# EAGLE design heatedBed (EAGLE 7.0.0)
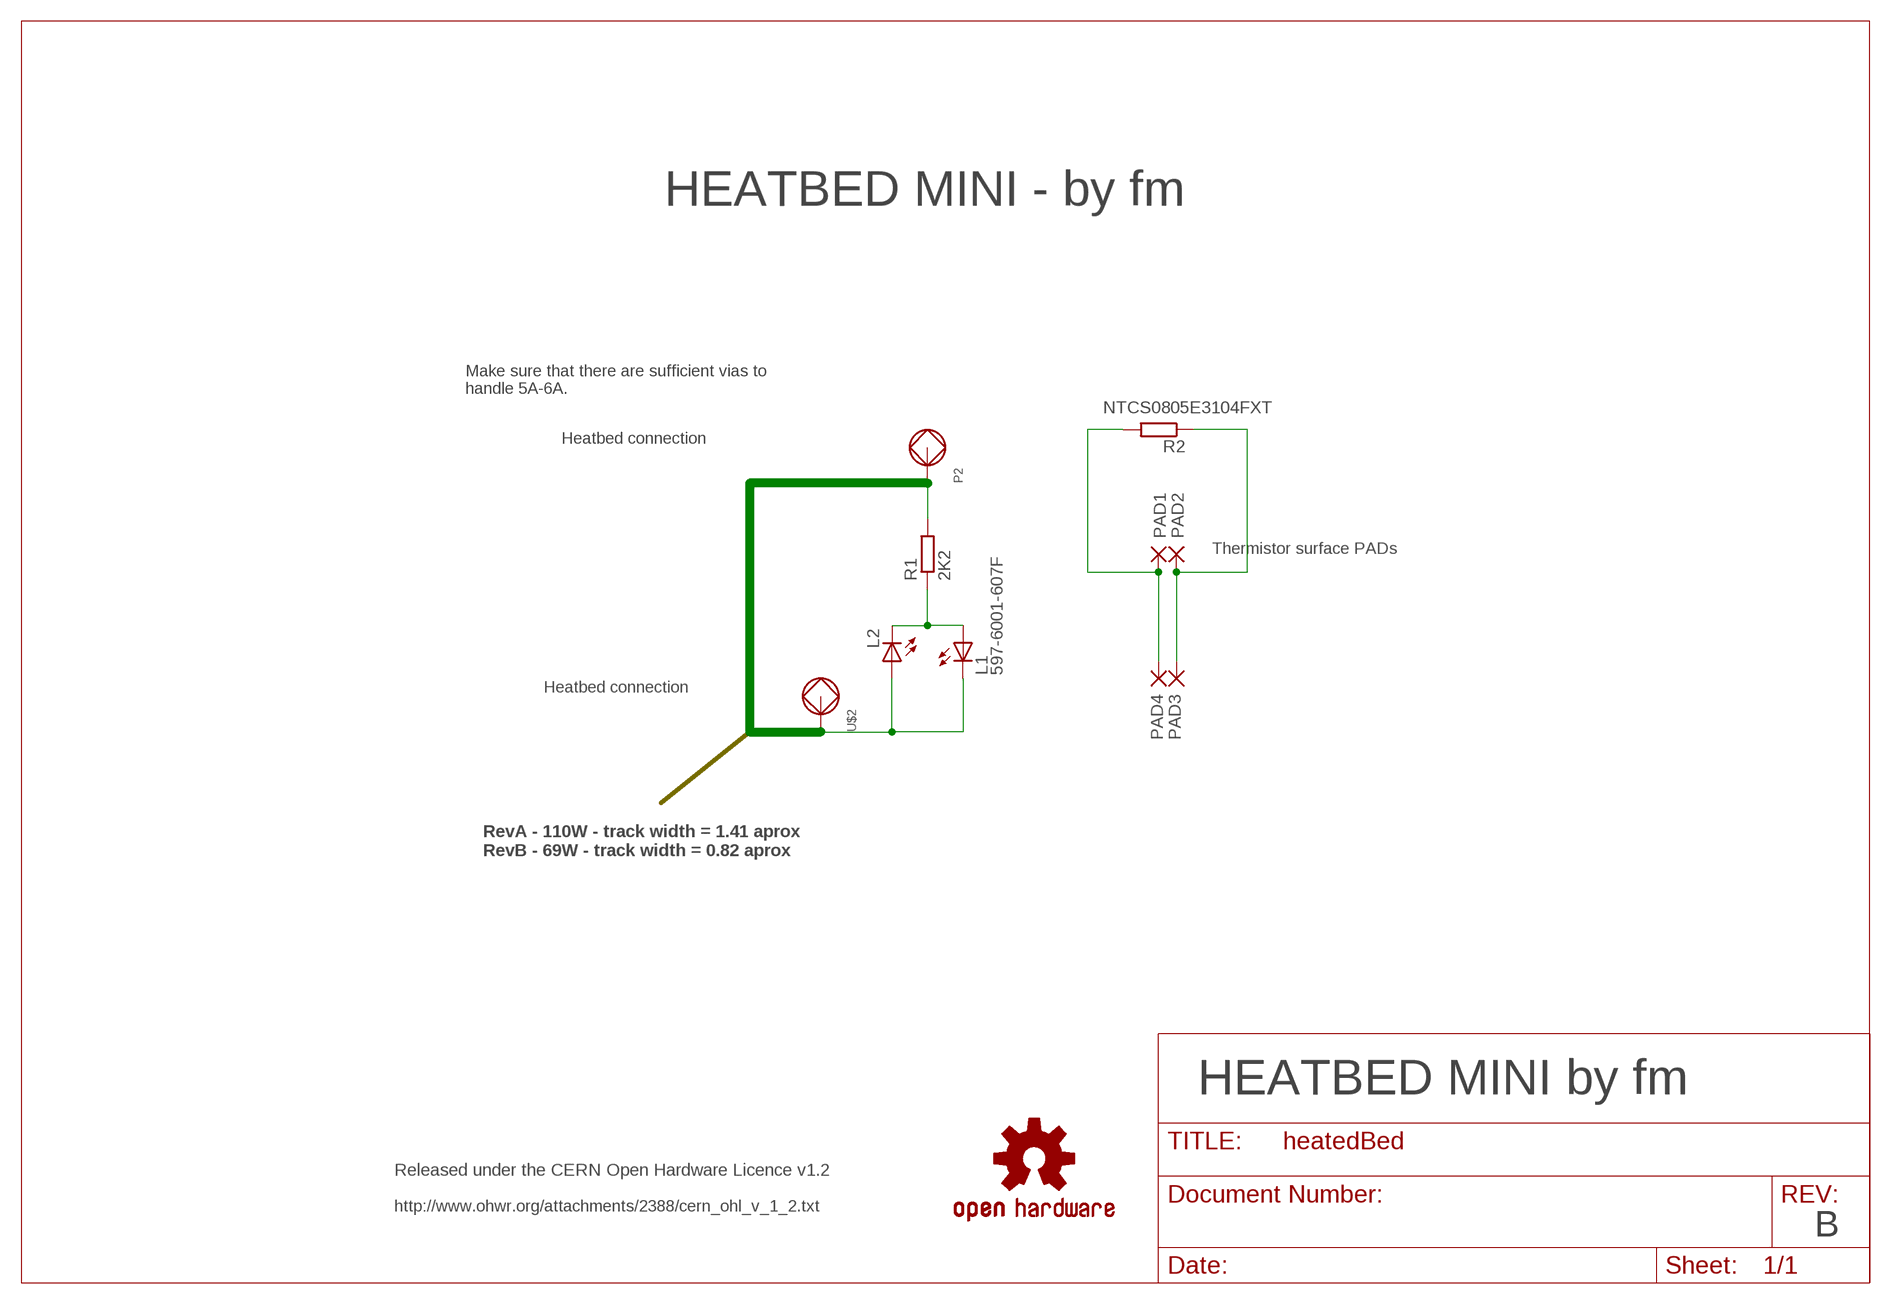
[diagram p0: schematic, sheet 1]

## Parts
L1  597-6001-607F  LEDCHIPLED_1206_REV  [CHIPLED_1206_REVERSE]
L2  LEDCHIPLED_1206_REV  [CHIPLED_1206_REVERSE]
P2  LONG_PAD  [LONG_PAD]
PAD1  SMD5  [SMD2,54-5,08]
PAD2  SMD5  [SMD2,54-5,08]
PAD3  SMD5  [SMD2,54-5,08]
PAD4  SMD5  [SMD2,54-5,08]
R1  2K2  R-EU_R0805  [R0805]
R2  NTCS0805E3104FXT  R-EU_R0805  [R0805]
U$2  LONG_PAD  [LONG_PAD]
U$5  SPARKFUN_OSHW-LOGOL  [SPARKFUN_OSHW-LOGO-L]

## Nets
N$3: PAD1.1(P) PAD4.1(P) R2.2
N$4: L1.A L2.C R1.1
N$5: PAD2.1(P) PAD3.1(P) R2.1
P1: L1.C L2.A P2.P$1 P2.P$2 P2.P$3 R1.2 U$2.P$1 U$2.P$2 U$2.P$3

## Notes on the sheet
- HEATBED MINI - by fm
- Make sure that there are sufficient vias to
  handle 5A-6A.
- Heatbed connection
- Thermistor surface PADs
- Heatbed connection
- RevA - 110W - track width = 1.41 aprox 
  RevB - 69W - track width = 0.82 aprox
- HEATBED MINI by fm
- Released under the CERN Open Hardware Licence v1.2
- http://www.ohwr.org/attachments/2388/cern_ohl_v_1_2.txt
- B

## Library data of the parts
L1 L2 = led:LED: LED OSRAM: - CHIPLED LG R971, LG N971, LY N971, LG Q971, LY Q971, LO R971, LY R971 LH N974, LH R974 LS Q976, LO Q976, LY Q976 LO Q996 - Hyper CHIPLED LW Q18S LB Q993, LB Q99A, LB R99A - SideLED LS A670, LO A670, LY A670, LG A670, LP A670 LB A673, LV A673, LT A673, LW A673 LH A674 LY A675 LS A676, LA A676, LO A676, LY A676, LW A676 LS A679, LY A679, LG A679 - Hyper Micro SIDELED® LS Y876, LA Y876, LO Y876, LY Y876 LT Y87S - SmartLED LW L88C, LW L88S LB L89C, LB L89S, LG L890 LS L89K, LO L89K, LY L89K LS L896, LA L896, LO L896, LY L896 - TOPLED LS T670, LO T670, LY T670, LG T670, LP T670 LSG T670, LSP T670, LSY T670, LOP T670, LYG T670 LG T671, LOG T671, LSG T671 LB T673, LV T673, LT T673, LW T673 LH T674 LS T676, LA T676, LO T676, LY T676, LB T676, LH T676, LSB T676, LW T676 LB T67C, LV T67C, LT T67C, LS T67K, LO T67K, LY T67K, LW E67C LS E67B, LA E67B, LO E67B, LY E67B, LB E67C, LV E67C, LT E67C LW T67C LS T679, LY T679, LG T679 LS T770, LO T770, LY T770, LG T770, LP T770 LB T773, LV T773, LT T773, LW T773 LH T774 LS E675, LA E675, LY E675, LS T675 LS T776, LA T776, LO T776, LY T776, LB T776 LHGB T686 LT T68C, LB T68C - Hyper Mini TOPLED® LB M676 - Mini TOPLED Santana® LG M470 LS M47K, LO M47K, LY M47K Source: http://www.osram.convergy.de LUXEON: - LUMILED® LXK2-PW12-R00, LXK2-PW12-S00, LXK2-PW14-U00, LXK2-PW14-V00 LXK2-PM12-R00, LXK2-PM12-S00, LXK2-PM14-U00 LXK2-PE12-Q00, LXK2-PE12-R00, LXK2-PE12-S00, LXK2-PE14-T00, LXK2-PE14-U00 LXK2-PB12-K00, LXK2-PB12-L00, LXK2-PB12-M00, LXK2-PB14-N00, LXK2-PB14-P00, LXK2-PB14-Q00 LXK2-PR12-L00, LXK2-PR12-M00, LXK2-PR14-Q00, LXK2-PR14-R00 LXK2-PD12-Q00, LXK2-PD12-R00, LXK2-PD12-S00 LXK2-PH12-R00, LXK2-PH12-S00 LXK2-PL12-P00, LXK2-PL12-Q00, LXK2-PL12-R00 Source: www.luxeon.com KINGBRIGHT: KA-3528ASYC Source: www.kingbright.com
P2 U$2 = fmc:LONG_PAD
PAD1-PAD4 = wirepad:SMD5: SMD PAD
R1 R2 = rcl:R-EU_: RESISTOR, European symbol
U$5 = SAVLibSAV MK-I:SPARKFUN_OSHW-LOGO: Open Source Hardware Logo This logo indicates the piece of hardware it is found on incorporates a OSHW license and/or adheres to the definition of open source hardware found here: http://freedomdefined.org/OSHW

## Board
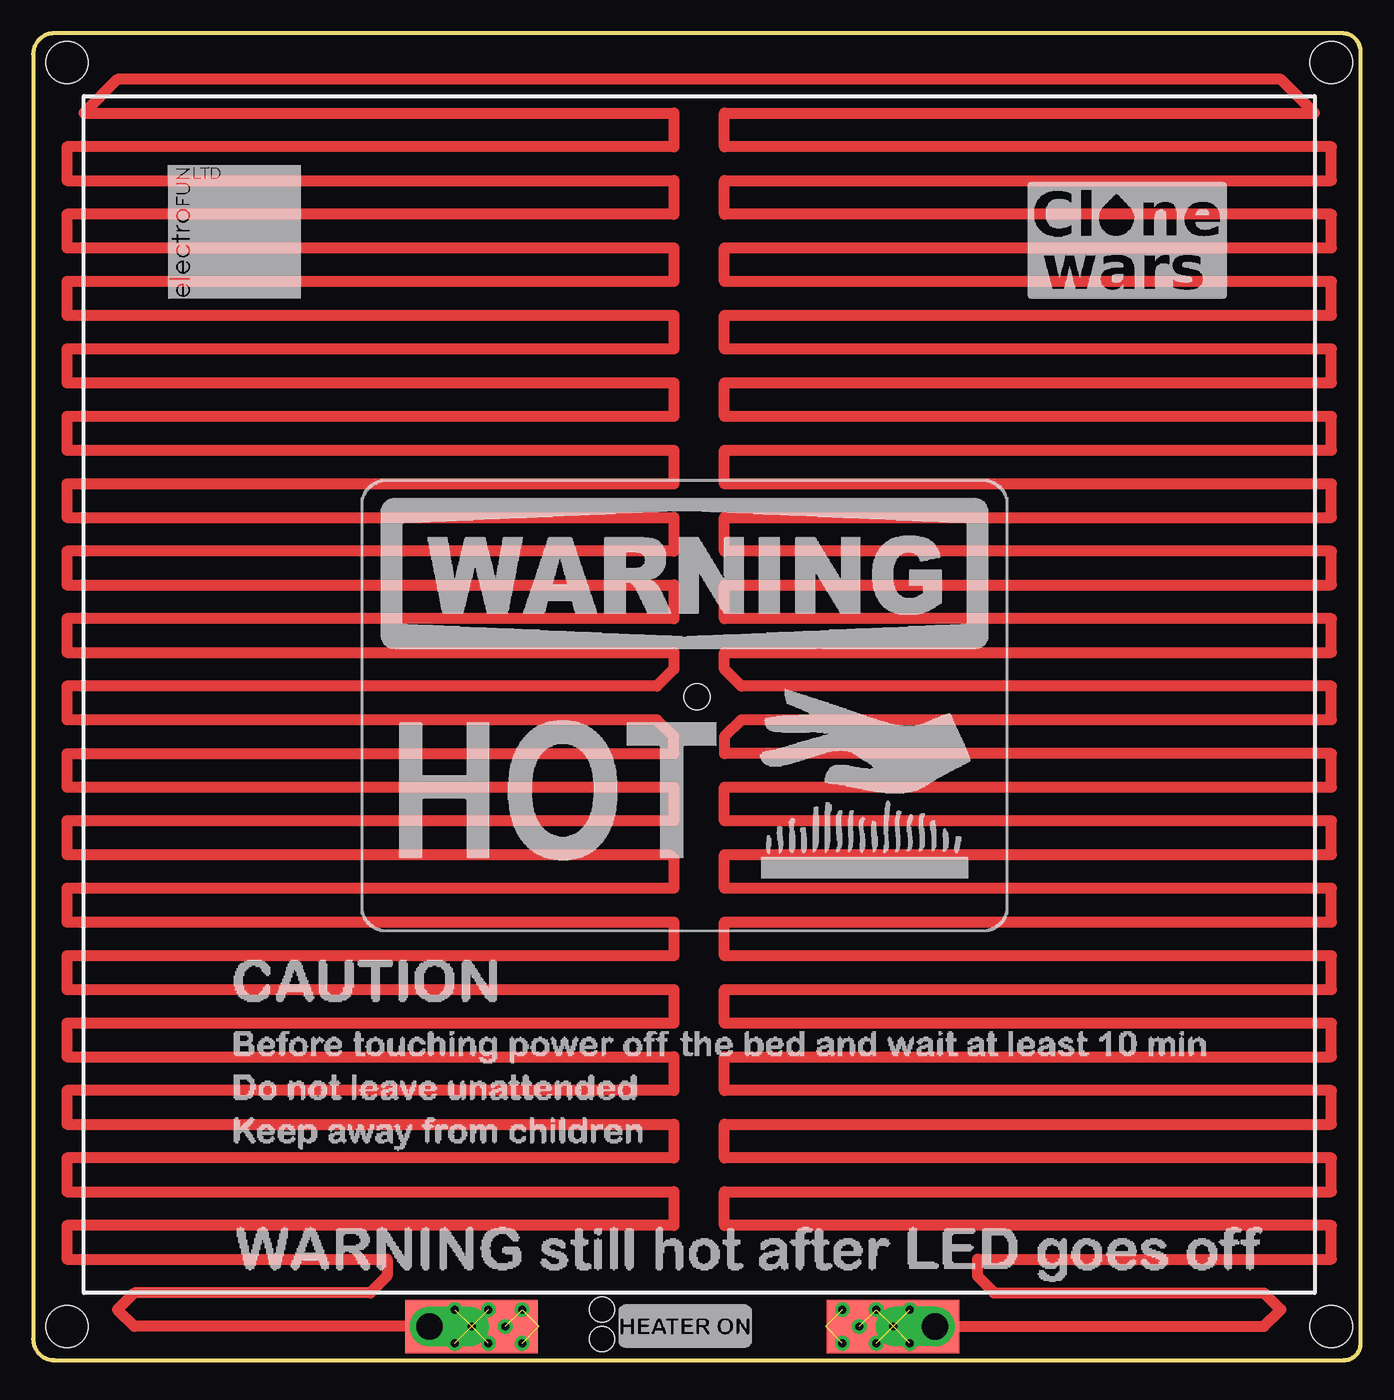
[diagram p1: board, top side]
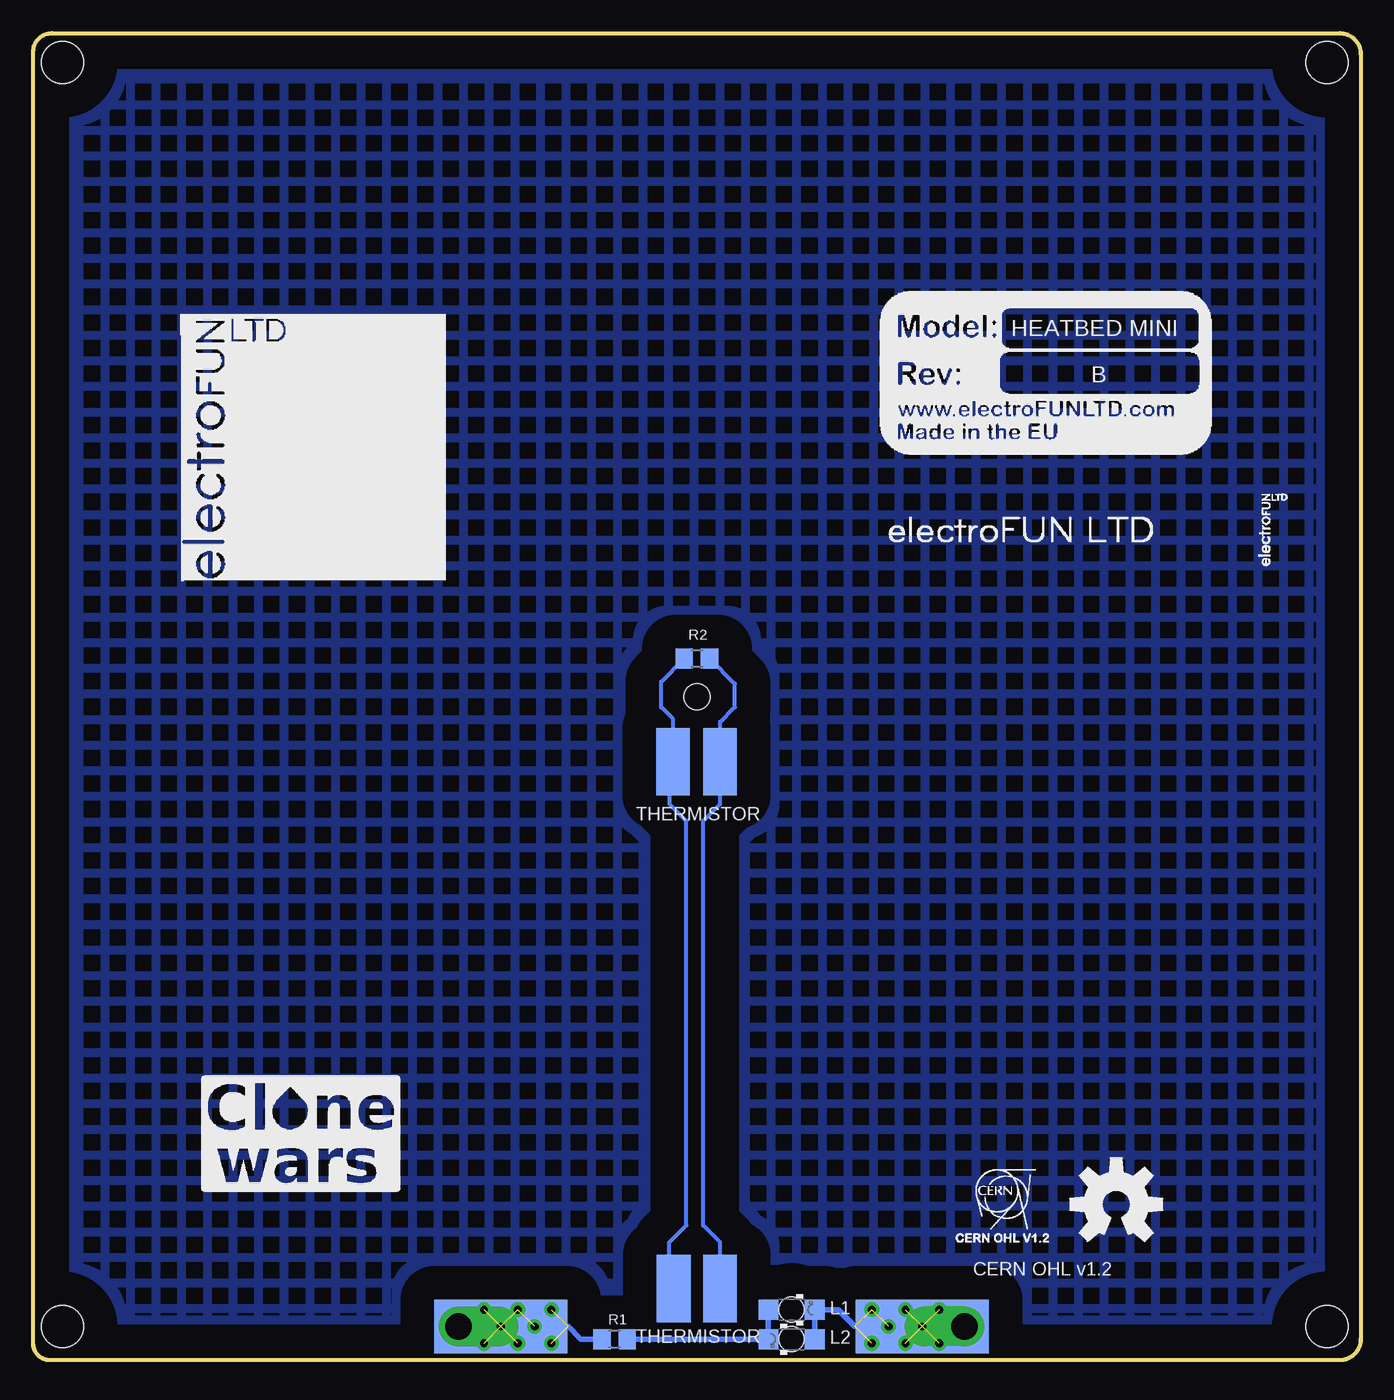
[diagram p2: board, bottom side, seen from below]

Size 100 x 100 mm. Coordinates in mm from the lower left corner, seen from the top.
Outline: 0,98.42 0,1.59 arc90 1.59,0 98.73,0 arc90 100,1.27 100,98.6 arc90 98.6,100 1.58,100 arc90 0,98.42
Copper layers (1*16): Top 0.035mm / dielectric 1.5mm / Bottom 0.035mm
Design rules "myDesignRules": minimum track width 8mil, minimum drill 20mil, track to track 8mil, track to pad 8mil, pad to pad 8mil, via to via 8mil, smd to smd 8mil, copper to edge 10mil, drill to drill 8mil, minimum pad ring 12mil, minimum via ring 10mil, stop-mask expansion 4mil, vias tented up to drill 25mil, thermal gap 10mil
Holes 2 mm at 50,50
Holes 3.2 mm at 97.79,2.54 2.54,2.54 2.54,97.79 97.79,97.79

### Footprints (pad centres in the part's own frame; a part is rotated, then mirrored left to right if it is on the bottom)
CHIPLED_1206_REVERSE = smd 1.5 x 1.5: A 0,-1.75; C 0,1.75 | hole 1.9: 0,0
LONG_PAD = smd 10 x 4 bottom: P$1 0,0 | smd 10 x 4: P$2 0,0 | drill 2 offset: P$3 3.175,0
SMD2,54-5,08 = smd 2.54 x 5.08: 1 0,0
R0805 = smd 1.3 x 1.5: 1 -0.95,0; 2 0.95,0

### Placement (x,y rotation side)
L1  42.86,3.81 270 bottom
L2  42.86,1.59 90 bottom
P2  64.77,2.54 0 top
PAD1  51.8,45.09 0 bottom
PAD2  48.26,45.09 0 bottom
PAD3  48.26,5.4 0 bottom
PAD4  51.75,5.4 0 bottom
R1  56.2,1.59 180 bottom
R2  50,52.86 180 bottom
U$1  [CAUTION]  13.97,2.54 0 top
U$2  33.02,2.54 180 top
U$3  [CLONE_WARS]  74.93,80.01 0 top
U$4  [CERN_OHL]  30.48,8.89 0 bottom
U$5  18.41,11.75 0 bottom
U$6  [ELECTROFUN_STRIP]  40.96,59.37 0 bottom
U$7  [CLONE_WARS]  87.31,12.7 0 bottom
U$8  [BOARD_REF]  36.2,68.26 0 bottom
U$9  [HEATERON]  44.13,0.95 0 top
U$10  [WARNING_HOT]  24.13,31.75 0 top
U$11  [ELECTROFUN_20X20]  88.9,58.74 0 bottom
U$12  [ELECTROFUN_10X10]  10.16,80.01 0 top

### Tracks (layer width: path | path; a pad name or v marks a point on that pad's centre or on a via)
N$1
  pour Bottom (isolate 2.54, hatched): 0,100.33 100.33,100.33 100.33,0 0,0
N$3
  Bottom 0.254: 51.8,45.45 PAD1.1
  Bottom 0.305: PAD4.1 52.07,5.08 52.07,8.89 50.8,10.16 50.8,40.64 52.07,41.91 52.07,44.81 PAD1.1 | 51.8,45.45 51.8,48.31 52.7,49.21 52.7,51.11 R2.2
N$4
  Bottom 0.406: L1.A L2.C R1.1
N$5
  Bottom 0.305: PAD3.1 48.26,8.89 49.53,10.16 49.53,40.64 48.26,41.91 PAD2.1 48.26,48.1 47.15,49.21 47.15,50.96 R2.1
P1  (via drill 0.6)  (14 unrouted)
  Top 0.82: P2.P$2 P2.P$3 92.71,2.54 93.98,3.81 92.71,5.08 72.39,5.08 71.12,6.35 71.12,7.62 97.79,7.62 97.79,10.16 52.07,10.16 52.07,12.7 97.79,12.7 97.79,15.24 52.07,15.24 52.07,17.78 97.79,17.78 97.79,20.32 52.07,20.32 52.07,22.86 97.79,22.86 97.79,25.4 52.07,25.4 52.07,27.94 97.79,27.94 97.79,30.48 52.07,30.48 52.07,33.02 97.79,33.02 97.79,35.56 52.07,35.56 52.07,38.1 97.79,38.1 97.79,40.64 52.07,40.64 52.07,43.18 97.79,43.18 97.79,45.72 52.07,45.72 52.07,46.99 53.34,48.26 97.79,48.26 97.79,50.8 53.34,50.8 52.07,52.07 52.07,53.34 97.79,53.34 97.79,55.88 52.07,55.88 52.07,58.42 97.79,58.42 97.79,60.96 52.07,60.96 52.07,63.5 97.79,63.5 97.79,66.04 52.07,66.04 52.07,68.58 97.79,68.58 97.79,71.12 52.07,71.12 52.07,73.66 97.79,73.66 97.79,76.2 52.07,76.2 52.07,78.74 97.79,78.74 97.79,81.28 52.07,81.28 52.07,83.82 97.79,83.82 97.79,86.36 52.07,86.36 52.07,88.9 97.79,88.9 97.79,91.44 52.07,91.44 52.07,93.98 96.52,93.98 93.98,96.52 6.35,96.52 3.81,93.98 48.26,93.98 48.26,91.44 2.54,91.44 2.54,88.9 48.26,88.9 48.26,86.36 2.54,86.36 2.54,83.82 48.26,83.82 48.26,81.28 2.54,81.28 2.54,78.74 48.26,78.74 48.26,76.2 2.54,76.2 2.54,73.66 48.26,73.66 48.26,71.12 2.54,71.12 2.54,68.58 48.26,68.58 48.26,66.04 2.54,66.04 2.54,63.5 48.26,63.5 48.26,60.96 2.54,60.96 2.54,58.42 48.26,58.42 48.26,55.88 2.54,55.88 2.54,53.34 48.26,53.34 48.26,52.07 46.99,50.8 2.54,50.8 2.54,48.26 46.99,48.26 48.26,46.99 48.26,45.72 2.54,45.72 2.54,43.18 48.26,43.18 48.26,40.64 2.54,40.64 2.54,38.1 47.94,38.1 48.26,37.78 48.26,35.56 2.54,35.56 2.54,33.02 48.26,33.02 48.26,30.48 2.54,30.48 2.54,27.94 48.26,27.94 48.26,25.4 2.54,25.4 2.54,22.86 48.26,22.86 48.26,20.32 2.54,20.32 2.54,17.78 48.26,17.78 48.26,15.24 2.54,15.24 2.54,12.7 48.26,12.7 48.26,10.16 2.54,10.16 2.54,7.62 26.67,7.62 26.67,6.35 25.4,5.08 7.62,5.08 6.35,3.81 7.62,2.54 U$2.P$3 U$2.P$2
  Bottom 0.406: L1.C 40.64,3.81 | L1.C L2.A | L1.C 39.37,3.81 38.1,2.54 U$2.P$2 | R1.2 58.74,1.59 59.69,2.54 P2.P$2
  other vias: 34.29,3.81 35.56,2.54 36.83,3.81 36.83,1.27 34.29,1.27 60.96,3.81 63.5,3.81 62.23,2.54 60.96,1.27 63.5,1.27 33.02,2.54 31.75,3.81 31.75,1.27 64.77,2.54 66.04,3.81 66.04,1.27

### Text on the board
bPlace: HEATBED MINI | B | THERMISTOR | CERN OHL v1.2 | THERMISTOR